# Altium schematic sheet RPI 3 Backpower.SchDoc
size A4
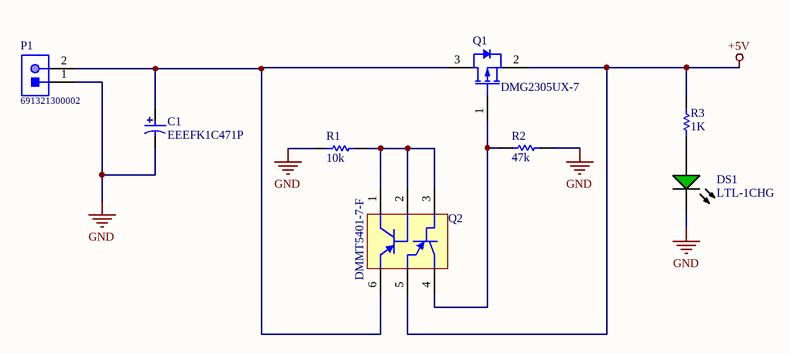
[diagram p0: RPI 3 Backpower.SchDoc]

## Parts
C1  EEEFK1C471P  [PNSC-FK-V-F_V]
DS1  LTL-1CHG  [LTST-LTL-1CHG-2]
P1  691321300002  [691321300002]
Q1  DMG2305UX-7  [DIOD-SOT23-3_A_V]
Q2  DMMT5401-7-F  [DIOD-SOT-26-6_N]
R1  10k  [RESC1609X55X30LL15T15]
R2  47k  [RESC1608X55X25LL10T15]
R3  1K  [RESC1608X55X30LL15T15]

## Nets
+5V: Q1.2(SOURCE) Q2.5(E2) R3.2
GND: C1.2 DS1.2(K) P1.1 R1.1 R2.1
NetC1_1: C1.1 P1.2 Q1.3(DRAIN) Q2.6(E1)
NetDS1_1: DS1.1(A) R3.1
NetQ1_1: Q1.1(GATE) Q2.4(C2) R2.2
NetQ2_1: Q2.1(C1) Q2.2(B1) Q2.3(B2) R1.2

## Library data of the parts
C1 = CMP-2000-06204-1: Aluminum Electrolytic Capacitor, 470 uF, +/- 20%, 16 V, 2-Pin SMD (Size Code F), -55 to 105 degC, RoHS, Tape and Reel; Manufacturer: Panasonic; Capacitance: 470µF; Type: Can; Ripple Current: 600mA; Lifetime@Temperature: 2000Hrs@105°C; Impedance: 0.16O; Rated Voltage: 16V; Manufacturer URL: http://www.panasonic.com/; Package Description: 2-Pin Electrolytic Aluminum Capacitor, Body 8.3 x 8.3 mm; Operating Temp-Max: 105°C; Mounting Technology: SurfaceMount; Operating Temp Range: -55to+105°C; Datasheet Version: 03/2016; Series: FK; Package Reference: FK-V-F; Case Size/Dimension: Ø8x10.2mm; Package URL: http://industrial.panasonic.com/cdbs/www-data/pdf/RDE0000/DME0000COL48.pdf; Datasheet URL: http://industrial.panasonic.com/cdbs/www-data/pdf/RDE0000/ABA0000C1181.pdf
DS1 = CMP-1674-00014-1: LITE-ON Electronic, INC, 120 mA, 100 mW, 5 V, -55 to 100 degC, 2-Pin THD, RoHS, Bulk; Case\Package: QFN; Max Supply Voltage: 3.6 V; Interface: I2C; Min Supply Voltage: 2.5 V; ComponentLink1URL: http://www.us.liteon.com/; DatasheetVersion: Mar-00; Max Operating Temperature: 85 degC; ComponentLink2URL: http://datasheet.octopart.com/LTL-1CHG-Lite-On-datasheet-143841.pdf; Min Operating Temperature: -40 degC; PackageReference: LTL-1CHG; RoHSCompliant: true; Pins: 24; PackageDescription: 2-Pin Through Hole Device, Dia 3.8 mm; ComponentLink1Description: Manufacturer URL; Packaging: Cut Tape; ComponentLink2Description: Datasheet; Package Quantity: 5000; REACH SVHC: No SVHC
P1 = CMP-1502-01863-1: Serie 321 - 3.81mm Vertical PCB Header WR-TBL, 2 pin; Manufacturer: Wurth Elektronik; Gender: Male; Pin Number: 2; Part Number: 691321300002; Mounting Technology: THT; Manufacturer URL: http://www.we-online.de; Datasheet URL: http://katalog.we-online.de/em/datasheet/6913213000xx.pdf; Packaging: Box; Package Reference: 691321300002; Publisher: WurthElektronik; Pitch: 3.81mm; Operating Temperature: -40to105degC
Q1 = CMP-1693-00002-3: P-Channel Enhancement Mode MOSFET, 20 V, -55 to 150 degC, 3-Pin SOT23, RoHS, Tape and Reel; RoHSCompliant: True; Pins: 3; PackageDescription: 3-Pin Small Outline Transistor, Body 2.9 x 1.3 mm, Pitch 0.915 mm; Min Operating Temperature: -55 degC; Mounting Technology: Surface Mount; ComponentLink2URL: http://www.diodes.com/_files/datasheets/DMG2305UX.pdf; PartNumber: DMG2305UX-7; ComponentLink1URL: http://www.diodes.com/; DatasheetVersion: Rev. 5-2; Max Operating Temperature: 150 degC; Packaging: Tape and Reel; Radiation Hardening: No; ComponentLink1Description: Manufacturer URL; Case/Package: TO-236-3; ComponentLink2Description: Datasheet; Package Quantity: 1; Mount: Surface Mount
Q2 = CMP-1667-00007-1: Matched PNP Small Signal Surface Mount Transistor, 300 mW, -55 to 150 degC, 6-Pin SOT-26, RoHS, Tape and Reel; Tolerance: 1%; Resistance: 56.2 kohm; Case\Package: 0603; Voltage Rating: 50 V; Power Rating: 100 mW; Width: 0.8 mm; ComponentLink2URL: http://www.diodes.com/_files/datasheets/ds30437.pdf; ComponentLink2Description: Datasheet; Min Operating Temperature: -55 degC; Max Operating Temperature: 155 degC; Height: 0.45 mm; Case Code (Metric): 1608; Package Quantity: 200; DatasheetVersion: Rev. 6-2, 05/2009; Packaging: Tape and Reel; Length: 1.6 mm; PackageDescription: 6-Pin Small Outline Transistor, Body 1.6 x 3 mm, Pitch 0.95 mm; RoHSCompliant: true; PackageReference: SOT-26-6; ComponentLink1URL: http://www.diodes.com/; Case Code (Imperial): 0603; ComponentLink1Description: Manufacturer URL
R1 = CMP-2000-07452-1: Chip Resistor, 10 KOhm, +/- 1%, 0.1 W, -55 to 155 degC, 0603 (1608 Metric), RoHS, Tape and Reel; Manufacturer: Panasonic; Voltage Rating: 75V; Case\/Package: 0603; Power Rating: 100mW; Resistance: 10KOhm; Temperature Coefficient: 100ppm\/degreesC; Number of Pins: 2; Package Reference: 603; Depth: 0.8mm; Mount: SurfaceMount; Package Description: 2-Pin Surface Mount Device, Body 1.6 x 0.85 mm; Datasheet Version: 02/2017; Length: 1.6mm; Lead Free: LeadFree; Height: 0.45mm; Number of Terminations: 2; Max Power Dissipation: 100mW; Min Operating Temperature: -55degC; Datasheet URL: https://industrial.panasonic.com/cdbs/www-data/pdf/RDA0000/AOA0000C304.pdf; Termination: SMD/SMT; Case Code (Metric): 1608; Case Code (Imperial): 0603; Tolerance: 1%; Max Operating Temperature: 155degC; RoHSCompliant: true; Voltage Rating (DC): 75V; Radiation Hardening: No; Packaging: TapeandReel; Composition: ThickFilm; Mounting Technology: SurfaceMount; Manufacturer URL: http://www.panasonic.com/; Width: 0.031inch; REACH SVHC: NoSVHC; Contact Plating: Tin; Military Standard: Not; Package Quantity: 1
R2 = CMP-2000-04844-1: Manufacturer: Yageo; Part Number: AC0603FR-0747KL
R3 = CMP-2000-00180-1: Part Number: ERJ-3EKF1001V; Manufacturer: Panasonic